# Altium schematic sheet MCU_STM32H743VIT6.SchDoc
size A2; Author: Nguyễn Huy Hoàng; SheetNumber: 5; SheetTotal: 5; Instructor: Nguyễn Trung Hiếu
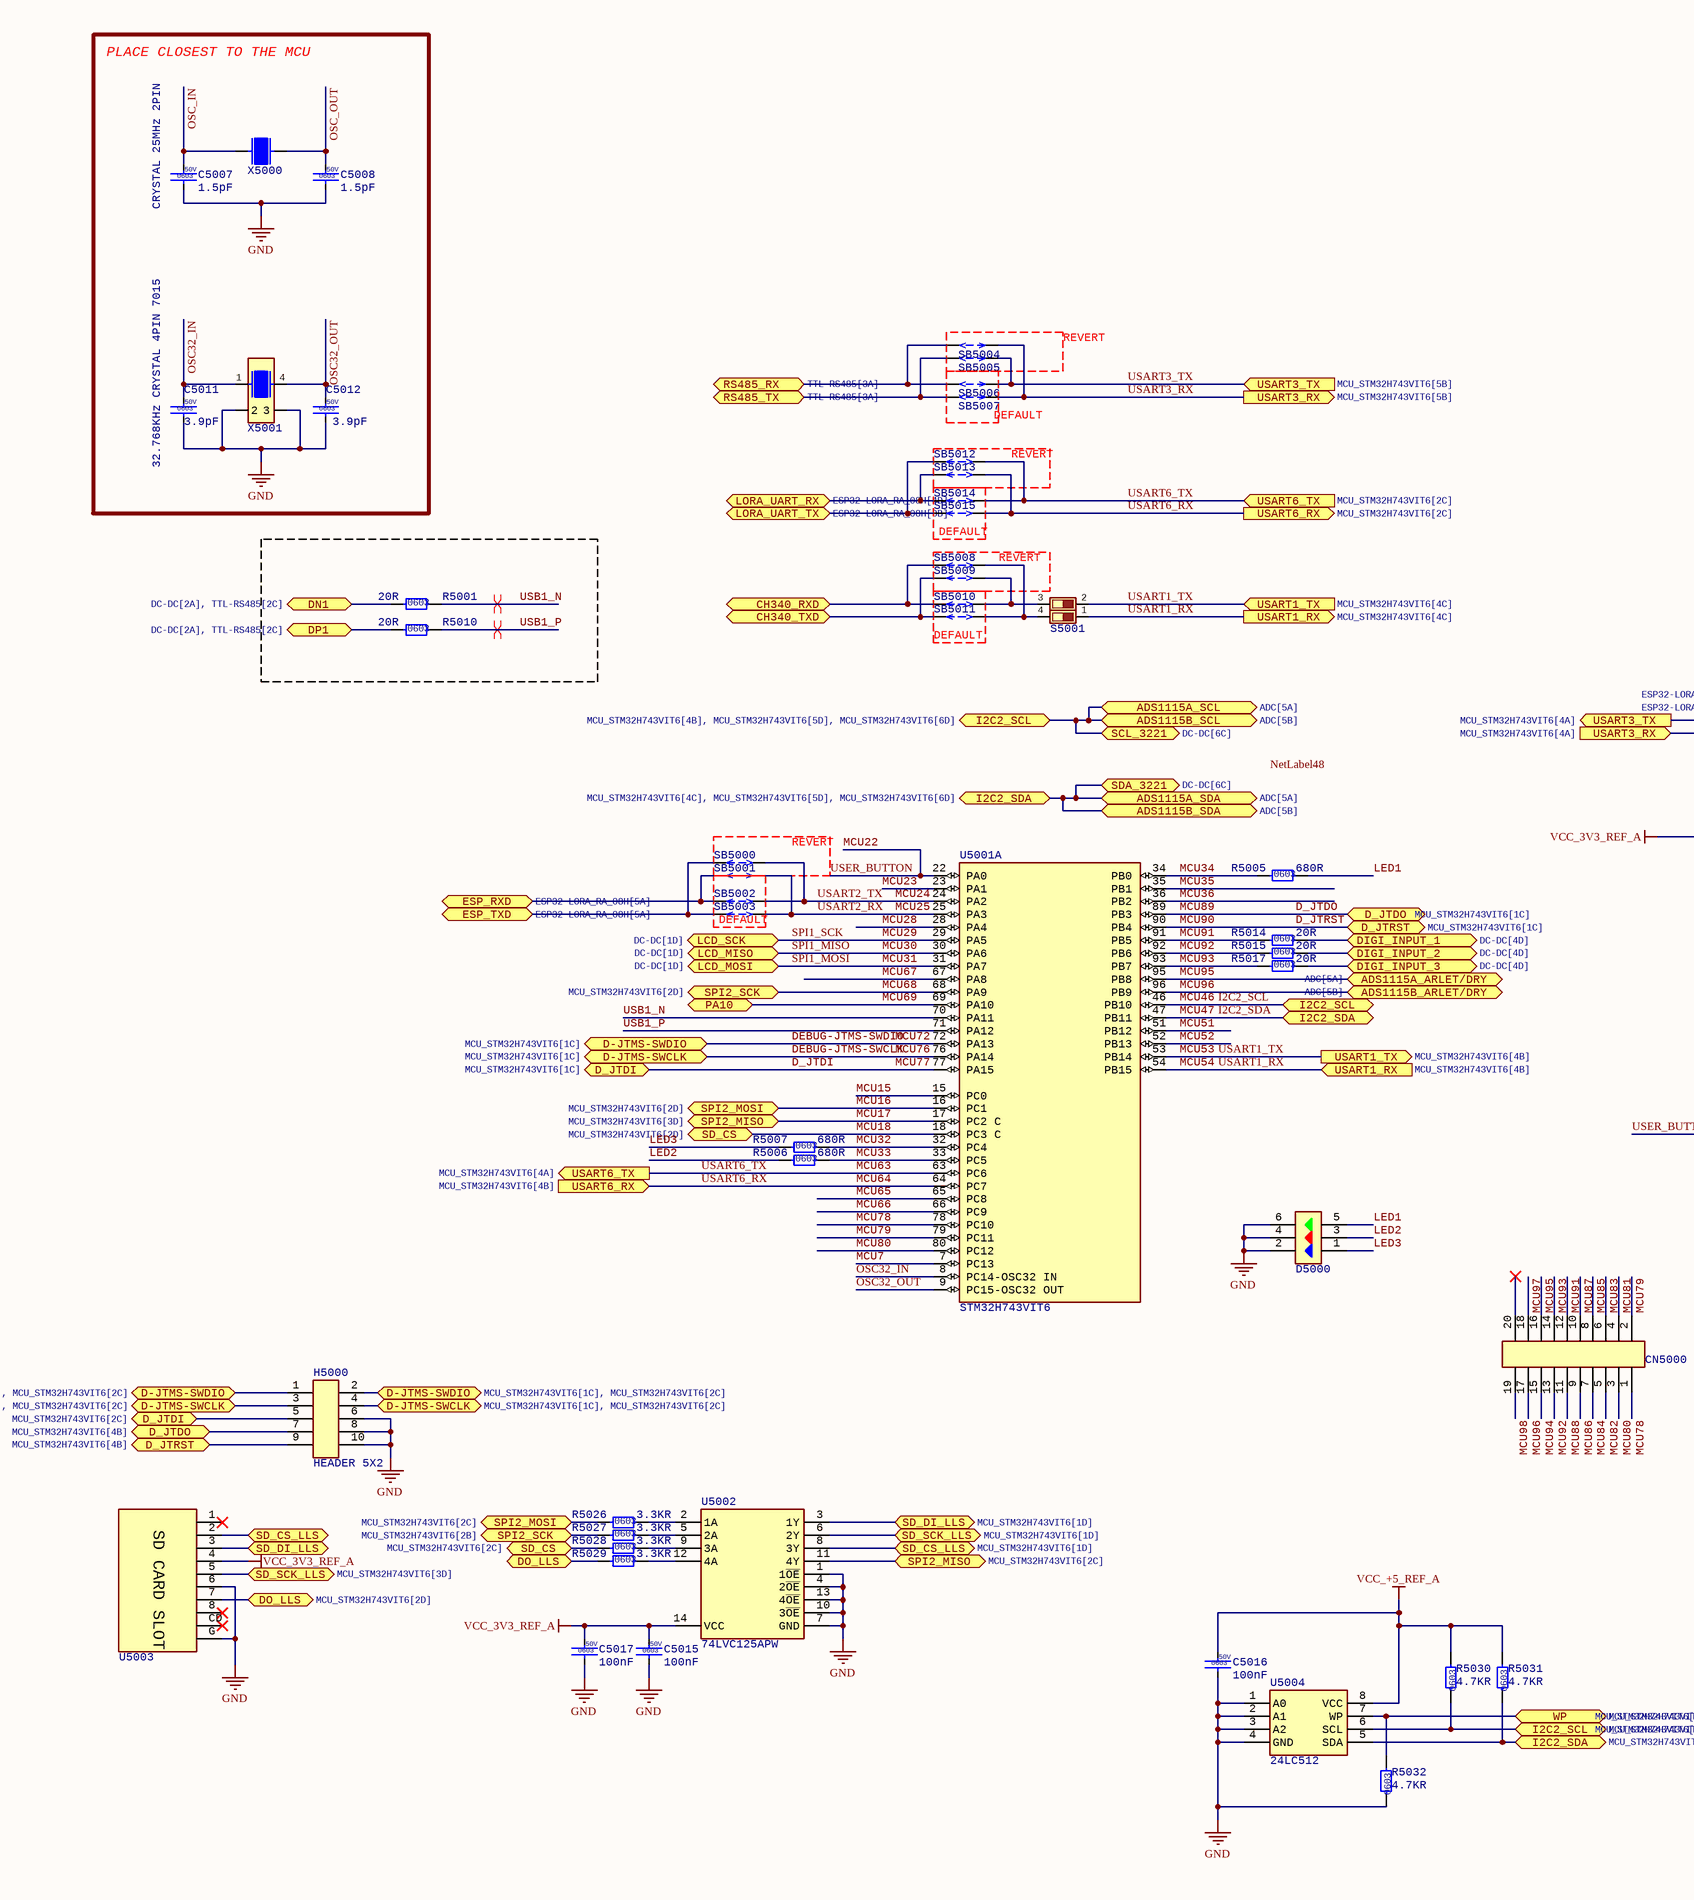
[diagram p0: MCU_STM32H743VIT6.SchDoc, left]
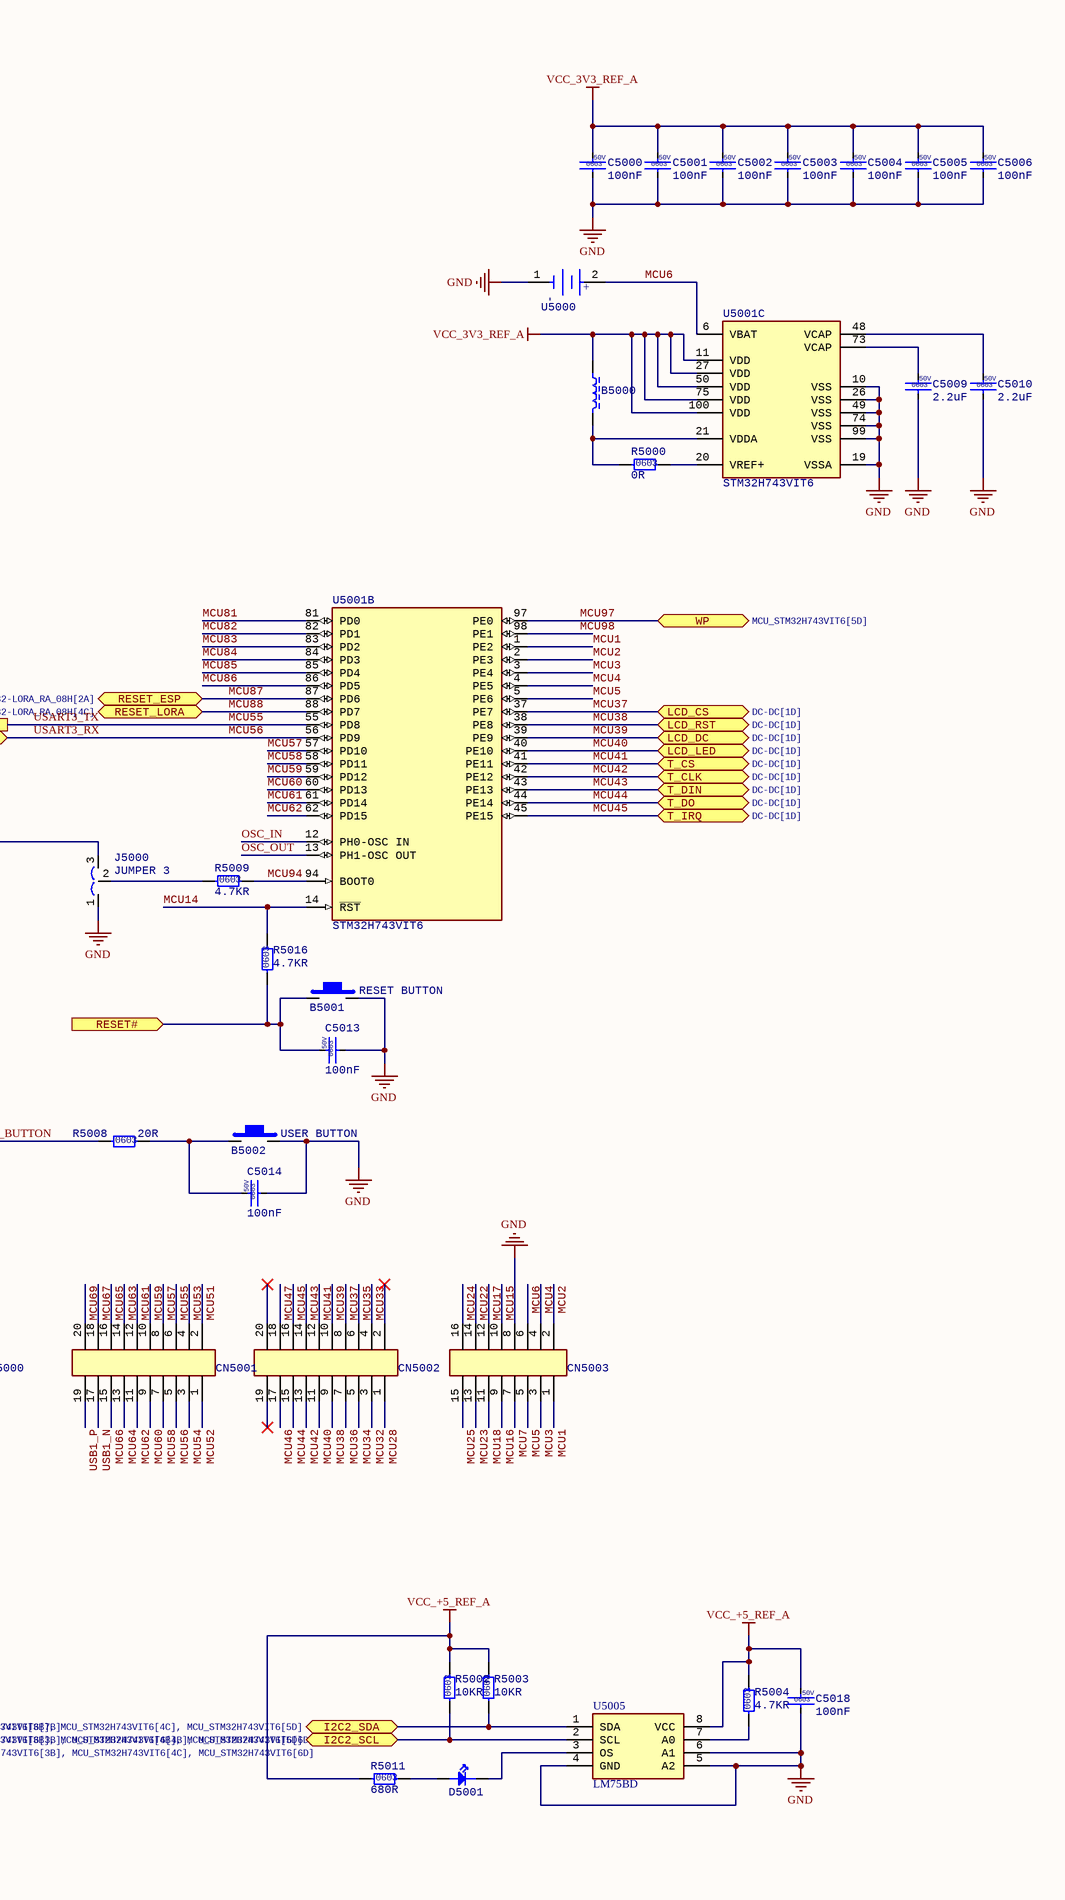
[diagram p1: MCU_STM32H743VIT6.SchDoc, right]

## Parts
B5000  FERRITE BEAD 600 OHM  [FERRITE BEAD 0603]  (value not drawn)
B5001  RESET BUTTON  [TACTILE 3X4MM]
B5002  USER BUTTON  [TACTILE 3X4MM]
C5000  100nF  Voltage: 50V  Size: 0603  [CAP CER 0603]
C5001  100nF  Voltage: 50V  Size: 0603  [CAP CER 0603]
C5002  100nF  Voltage: 50V  Size: 0603  [CAP CER 0603]
C5003  100nF  Voltage: 50V  Size: 0603  [CAP CER 0603]
C5004  100nF  Voltage: 50V  Size: 0603  [CAP CER 0603]
C5005  100nF  Voltage: 50V  Size: 0603  [CAP CER 0603]
C5006  100nF  Voltage: 50V  Size: 0603  [CAP CER 0603]
C5007  1.5pF  Voltage: 50V  Size: 0603  [CAP CER 0603]
C5008  1.5pF  Voltage: 50V  Size: 0603  [CAP CER 0603]
C5009  2.2uF  Voltage: 50V  Size: 0603  [CAP CER 0603]
C5010  2.2uF  Voltage: 50V  Size: 0603  [CAP CER 0603]
C5011  3.9pF  Voltage: 50V  Size: 0603  [CAP CER 0603]
C5012  3.9pF  Voltage: 50V  Size: 0603  [CAP CER 0603]
C5013  100nF  Voltage: 50V  Size: 0603  [CAP CER 0603]
C5014  100nF  Voltage: 50V  Size: 0603  [CAP CER 0603]
C5015  100nF  Voltage: 50V  Size: 0603  [CAP CER 0603]
C5016  100nF  Voltage: 50V  Size: 0603  [CAP CER 0603]
C5017  100nF  Voltage: 50V  Size: 0603  [CAP CER 0603]
C5018  100nF  Voltage: 50V  Size: 0603  [CAP CER 0603]
CN5000  SMD HEADER 10X2X2.54MM  [SMD HEADER 10X2X2.54MM]  (value not drawn)
CN5001  SMD HEADER 10X2X2.54MM  [SMD HEADER 10X2X2.54MM]  (value not drawn)
CN5002  SMD HEADER 10X2X2.54MM  [SMD HEADER 10X2X2.54MM]  (value not drawn)
CN5003  SMD HEADER 8X2X2.54MM  [SMD HEADER 8X2X2.54MM]  (value not drawn)
D5000  LED RGB 5050  [LED RGB 5050]  (value not drawn)
D5001  LED RED  [LED RED 0603]  (value not drawn)
H5000  HEADER 5X2  [HEADER 5X2]
J5000  JUMPER 3  [JUMPER 3]
R5000  0R  Size: 0603  [RESC 0603(1608) SMD]
R5001  20R  Size: 0603  [RESC 0603(1608) SMD]
R5002  10KR  Size: 0603  [RESC 0603(1608) SMD]
R5003  10KR  Size: 0603  [RESC 0603(1608) SMD]
R5004  4.7KR  Size: 0603  [RESC 0603(1608) SMD]
R5005  680R  Size: 0603  [RESC 0603(1608) SMD]
R5006  680R  Size: 0603  [RESC 0603(1608) SMD]
R5007  680R  Size: 0603  [RESC 0603(1608) SMD]
R5008  20R  Size: 0603  [RESC 0603(1608) SMD]
R5009  4.7KR  Size: 0603  [RESC 0603(1608) SMD]
R5010  20R  Size: 0603  [RESC 0603(1608) SMD]
R5011  680R  Size: 0603  [RESC 0603(1608) SMD]
R5014  20R  Size: 0603  [RESC 0603(1608) SMD]
R5015  20R  Size: 0603  [RESC 0603(1608) SMD]
R5016  4.7KR  Size: 0603  [RESC 0603(1608) SMD]
R5017  20R  Size: 0603  [RESC 0603(1608) SMD]
R5026  3.3KR  Size: 0603  [RESC 0603(1608) SMD]
R5027  3.3KR  Size: 0603  [RESC 0603(1608) SMD]
R5028  3.3KR  Size: 0603  [RESC 0603(1608) SMD]
R5029  3.3KR  Size: 0603  [RESC 0603(1608) SMD]
R5030  4.7KR  Size: 0603  [RESC 0603(1608) SMD]
R5031  4.7KR  Size: 0603  [RESC 0603(1608) SMD]
R5032  4.7KR  Size: 0603  [RESC 0603(1608) SMD]
S5001  DIP-2  [DIP-2 SWITCH]  (value not drawn)
SB5000  SB  [SB]  (value not drawn)
SB5001  SB  [SB]  (value not drawn)
SB5002  SB  [SB]  (value not drawn)
SB5003  SB  [SB]  (value not drawn)
SB5004  SB  [SB]  (value not drawn)
SB5005  SB  [SB]  (value not drawn)
SB5006  SB  [SB]  (value not drawn)
SB5007  SB  [SB]  (value not drawn)
SB5008  SB  [SB]  (value not drawn)
SB5009  SB  [SB]  (value not drawn)
SB5010  SB  [SB]  (value not drawn)
SB5011  SB  [SB]  (value not drawn)
SB5012  SB  [SB]  (value not drawn)
SB5013  SB  [SB]  (value not drawn)
SB5014  SB  [SB]  (value not drawn)
SB5015  SB  [SB]  (value not drawn)
U5000  BS-6  [BS-6]  (value not drawn)
U5001  STM32H743VIT6  [LQFP-100-A]  (parts A,B,C of 3)
U5002  74LVC125APW  [TSSOP-14]
U5003  MiSD-PP-9P-V2  [MiSD-PP-9P-V2]  (value not drawn)
U5004  24LC512  [SOIC-8]
U5005  LM75BD  [SOP-8]
X5000  CRYSTAL 25MHz 2PIN  [CRYSTAL 5032 2PIN]
X5001  32.768KHz CRYSTAL 4PIN 7015  [CRYSTAL 32.768KHz 7015]

## Blocks framed on the sheet
PLACE CLOSEST TO THE MCU: C5007 C5008 C5011 C5012 X5000 X5001
DEFAULT: SB5006 SB5007
DEFAULT: SB5014 SB5015
REVERT: SB5012 SB5013
DEFAULT: SB5010 SB5011
REVERT: SB5008 SB5009
REVERT: SB5000 SB5001
DEFAULT: SB5002 SB5003

## Ports
ADS1115A_ARLET/DRY (bidir, see ADC[5A]), ADS1115A_SCL (bidir, see ADC[5A]), ADS1115A_SDA (bidir, see ADC[5A]), ADS1115B_ARLET/DRY (bidir, see ADC[5B]), ADS1115B_SCL (bidir, see ADC[5B]), ADS1115B_SDA (bidir, see ADC[5B]), CH340_RXD (bidir, see ESP32-LORA_RA_08H[1B], ESP32-LORA_RA_08H[2B], TTL-RS485[2B]), CH340_TXD (bidir, see ESP32-LORA_RA_08H[1B], ESP32-LORA_RA_08H[2B], TTL-RS485[2B]), D-JTMS-SWCLK (bidir, see MCU_STM32H743VIT6[1C]), D-JTMS-SWCLK (bidir, see MCU_STM32H743VIT6[1C], MCU_STM32H743VIT6[2C]), D-JTMS-SWDIO (bidir, see MCU_STM32H743VIT6[1C]), D-JTMS-SWDIO (bidir, see MCU_STM32H743VIT6[1C], MCU_STM32H743VIT6[2C]), D_JTDI (bidir, see MCU_STM32H743VIT6[1C]), D_JTDI (bidir, see MCU_STM32H743VIT6[2C]), D_JTDO (bidir, see MCU_STM32H743VIT6[1C]), D_JTDO (bidir, see MCU_STM32H743VIT6[4B]), D_JTRST (bidir, see MCU_STM32H743VIT6[1C]), D_JTRST (bidir, see MCU_STM32H743VIT6[4B]), DIGI_INPUT_1 (bidir, see DC-DC[4D]), DIGI_INPUT_2 (bidir, see DC-DC[4D]), DIGI_INPUT_3 (bidir, see DC-DC[4D]), DN1 (bidir, see DC-DC[2A], TTL-RS485[2C]), DO_LLS (bidir, see MCU_STM32H743VIT6[1D]), DO_LLS (bidir, see MCU_STM32H743VIT6[2D]), DP1 (bidir, see DC-DC[2A], TTL-RS485[2C]), ESP_RXD (bidir, see ESP32-LORA_RA_08H[5A]), ESP_TXD (bidir, see ESP32-LORA_RA_08H[5A]), I2C2_SCL (bidir, see MCU_STM32H743VIT6[3B], MCU_STM32H743VIT6[4B], MCU_STM32H743VIT6[5D]), I2C2_SCL (bidir, see MCU_STM32H743VIT6[3B], MCU_STM32H743VIT6[4B], MCU_STM32H743VIT6[6D]), I2C2_SCL (bidir, see MCU_STM32H743VIT6[3B], MCU_STM32H743VIT6[5D], MCU_STM32H743VIT6[6D]), I2C2_SCL (bidir, see MCU_STM32H743VIT6[4B], MCU_STM32H743VIT6[5D], MCU_STM32H743VIT6[6D]), I2C2_SDA (bidir, see MCU_STM32H743VIT6[3B], MCU_STM32H743VIT6[4C], MCU_STM32H743VIT6[5D]), I2C2_SDA (bidir, see MCU_STM32H743VIT6[3B], MCU_STM32H743VIT6[4C], MCU_STM32H743VIT6[6D]), I2C2_SDA (bidir, see MCU_STM32H743VIT6[3B], MCU_STM32H743VIT6[5D], MCU_STM32H743VIT6[6D]), I2C2_SDA (bidir, see MCU_STM32H743VIT6[4C], MCU_STM32H743VIT6[5D], MCU_STM32H743VIT6[6D]), LCD_CS (bidir, see DC-DC[1D]), LCD_DC (bidir, see DC-DC[1D]), LCD_LED (bidir, see DC-DC[1D]), LCD_MISO (bidir, see DC-DC[1D]), LCD_MOSI (bidir, see DC-DC[1D]), LCD_RST (bidir, see DC-DC[1D]), LCD_SCK (bidir, see DC-DC[1D]), LORA_UART_RX (bidir, see ESP32-LORA_RA_08H[4D]), LORA_UART_TX (bidir, see ESP32-LORA_RA_08H[3B]), PA10 (bidir), RESET# (in), RESET_ESP (bidir, see ESP32-LORA_RA_08H[2A]), RESET_LORA (bidir, see ESP32-LORA_RA_08H[4C]), RS485_RX (bidir, see TTL-RS485[3A]), RS485_TX (bidir, see TTL-RS485[3A]), SCL_3221 (bidir, see DC-DC[6C]), SD_CS (bidir, see MCU_STM32H743VIT6[2C]), SD_CS (bidir, see MCU_STM32H743VIT6[2D]), SD_CS_LLS (bidir, see MCU_STM32H743VIT6[1D]), SD_CS_LLS (bidir, see MCU_STM32H743VIT6[3D]), SD_DI_LLS (bidir, see MCU_STM32H743VIT6[1D]), SD_DI_LLS (bidir, see MCU_STM32H743VIT6[3D]), SD_SCK_LLS (bidir, see MCU_STM32H743VIT6[1D]), SD_SCK_LLS (bidir, see MCU_STM32H743VIT6[3D]), SDA_3221 (bidir, see DC-DC[6C]), SPI2_MISO (bidir, see MCU_STM32H743VIT6[2C]), SPI2_MISO (bidir, see MCU_STM32H743VIT6[3D]), SPI2_MOSI (bidir, see MCU_STM32H743VIT6[2C]), SPI2_MOSI (bidir, see MCU_STM32H743VIT6[2D]), SPI2_SCK (bidir, see MCU_STM32H743VIT6[2B]), SPI2_SCK (bidir, see MCU_STM32H743VIT6[2D]), T_CLK (bidir, see DC-DC[1D]), T_CS (bidir, see DC-DC[1D]), T_DIN (bidir, see DC-DC[1D]), T_DO (bidir, see DC-DC[1D]), T_IRQ (bidir, see DC-DC[1D]), USART1_RX (in, see MCU_STM32H743VIT6[4B]), USART1_RX (out, see MCU_STM32H743VIT6[4C]), USART1_TX (in, see MCU_STM32H743VIT6[4C]), USART1_TX (out, see MCU_STM32H743VIT6[4B]), USART3_RX (in, see MCU_STM32H743VIT6[4A]), USART3_RX (out, see MCU_STM32H743VIT6[5B]), USART3_TX (in, see MCU_STM32H743VIT6[5B]), USART3_TX (out, see MCU_STM32H743VIT6[4A]), USART6_RX (in, see MCU_STM32H743VIT6[4B]), USART6_RX (out, see MCU_STM32H743VIT6[2C]), USART6_TX (in, see MCU_STM32H743VIT6[2C]), USART6_TX (out, see MCU_STM32H743VIT6[4A]), WP (bidir, see MCU_STM32H743VIT6[5D]), WP (bidir, see MCU_STM32H743VIT6[7B])

## Nets
GND: B5001.2 B5002.2 C5000.2 C5001.2 C5002.2 C5003.2 C5004.2 C5005.2 C5006.2 C5007.2 C5008.2 C5009.2 C5010.2 C5011.2 C5012.2 C5013.2 C5014.2 C5015.2 C5016.2 C5017.2 C5018.2 CN5003.8 D5000.2 D5000.4 D5000.6 H5000.6 H5000.8 H5000.10 J5000.1 R5032.2 U5000.1(C) U5001.10(VSS) U5001.19(VSSA) U5001.26(VSS) U5001.49(VSS) U5001.74(VSS) U5001.99(VSS) U5002.1(1~{OE}) U5002.4(2~{OE}) U5002.7(GND) U5002.10(3~{OE}) U5002.13(4~{OE}) U5003.6 U5003.G U5004.1(A0) U5004.2(A1) U5004.3(A2) U5004.4(GND) U5005.4(GND) U5005.5(A2) U5005.6(A1) X5001.2 X5001.3
VCC_3V3_REF_A: B5000.1 C5000.1 C5001.1 C5002.1 C5003.1 C5004.1 C5005.1 C5006.1 C5015.1 C5017.1 J5000.3 U5001.11(VDD) U5001.27(VDD) U5001.50(VDD) U5001.75(VDD) U5001.100(VDD) U5002.14(VCC) U5003.4
VCC_+5_REF_A: C5016.1 C5018.1 R5002.2 R5003.2 R5004.2 R5011.1 R5030.1 R5031.1 U5004.8(VCC) U5005.8(VCC)
CH340_RXD: SB5008.1 SB5010.1 ; port CH340_RXD
CH340_TXD: SB5009.1 SB5011.1 ; port CH340_TXD
D_JTDI: H5000.5 U5001.77(PA15) ; port D_JTDI  [also labelled MCU77]
D_JTDO: H5000.7 U5001.89(PB3) ; port D_JTDO  [also labelled MCU89]
D_JTRST: H5000.9 U5001.90(PB4) ; port D_JTRST  [also labelled MCU90]
DEBUG-JTMS-SWCLK: H5000.3 H5000.4 U5001.76(PA14) ; port D-JTMS-SWCLK  [also labelled MCU76]
DEBUG-JTMS-SWDIO: H5000.1 H5000.2 U5001.72(PA13) ; port D-JTMS-SWDIO  [also labelled MCU72]
DIGI_INPUT_1: R5014.2 ; port DIGI_INPUT_1
DIGI_INPUT_2: R5015.2 ; port DIGI_INPUT_2
DIGI_INPUT_3: R5017.2 ; port DIGI_INPUT_3
DN1: R5001.1 ; port DN1
DO_LLS: R5029.1 U5003.7 ; port DO_LLS
DP1: R5010.1 ; port DP1
ESP_RXD: SB5001.1 SB5002.1 ; port ESP_RXD
ESP_TXD: SB5000.1 SB5003.1 ; port ESP_TXD
I2C2_SCL: CN5002.17 R5002.1 R5030.2 U5001.46(PB10) U5004.6(SCL) U5005.2(SCL) ; port ADS1115A_SCL, port ADS1115B_SCL, port SCL_3221, port I2C2_SCL  [also labelled MCU46]
I2C2_SDA: CN5002.18 R5003.1 R5031.2 U5001.47(PB11) U5004.5(SDA) U5005.1(SDA) ; port ADS1115A_SDA, port ADS1115B_SDA, port SDA_3221, port I2C2_SDA  [also labelled MCU47]
LED1: D5000.5 R5005.2
LED2: D5000.3 R5006.1
LED3: D5000.1 R5007.1
LORA_UART_RX: SB5013.1 SB5014.1 ; port LORA_UART_RX
LORA_UART_TX: SB5012.1 SB5015.1 ; port LORA_UART_TX
MCU1: CN5003.1 U5001.1(PE2)
MCU2: CN5003.2 U5001.2(PE3)
MCU3: CN5003.3 U5001.3(PE4)
MCU4: CN5003.4 U5001.4(PE5)
MCU5: CN5003.5 U5001.5(PE6)
MCU6: CN5003.6 U5000.2(A) U5001.6(VBAT)
MCU7: CN5003.7 U5001.7(PC13)
MCU14: R5016.2 U5001.14(~{RST})
MCU15: CN5003.10 U5001.15(PC0)
MCU16: CN5003.9 R5026.1 U5001.16(PC1) ; port SPI2_MOSI
MCU17: CN5003.12 U5001.17(PC2_C) U5002.11(4Y) ; port SPI2_MISO
MCU18: CN5003.11 R5028.1 U5001.18(PC3_C) ; port SD_CS
MCU22: CN5003.14 R5008.1 U5001.22(PA0)  [also labelled USER_BUTTON]
MCU23: CN5003.13 U5001.23(PA1)
MCU24: CN5003.16 SB5000.2 SB5002.2 U5001.24(PA2)  [also labelled USART2_TX]
MCU25: CN5003.15 SB5001.2 SB5003.2 U5001.25(PA3)  [also labelled USART2_RX]
MCU28: CN5002.1 U5001.28(PA4)
MCU29: U5001.29(PA5) ; port LCD_SCK  [also labelled SPI1_SCK]
MCU30: U5001.30(PA6) ; port LCD_MISO  [also labelled SPI1_MISO]
MCU31: U5001.31(PA7) ; port LCD_MOSI  [also labelled SPI1_MOSI]
MCU32: CN5002.3 R5007.2 U5001.32(PC4)
MCU33: CN5002.4 R5006.2 U5001.33(PC5)
MCU34: CN5002.5 R5005.1 U5001.34(PB0)
MCU35: CN5002.6 U5001.35(PB1)
MCU36: CN5002.7 U5001.36(PB2)
MCU37: CN5002.8 U5001.37(PE7) ; port LCD_CS
MCU38: CN5002.9 U5001.38(PE8) ; port LCD_RST
MCU39: CN5002.10 U5001.39(PE9) ; port LCD_DC
MCU40: CN5002.11 U5001.40(PE10) ; port LCD_LED
MCU41: CN5002.12 U5001.41(PE11) ; port T_CS
MCU42: CN5002.13 U5001.42(PE12) ; port T_CLK
MCU43: CN5002.14 U5001.43(PE13) ; port T_DIN
MCU44: CN5002.15 U5001.44(PE14) ; port T_DO
MCU45: CN5002.16 U5001.45(PE15) ; port T_IRQ
MCU51: CN5001.2 U5001.51(PB12)
MCU52: CN5001.1 U5001.52(PB13)
MCU53: CN5001.4 S5001.2 U5001.53(PB14) ; port USART1_TX  [also labelled USART1_TX]
MCU54: CN5001.3 S5001.1 U5001.54(PB15) ; port USART1_RX  [also labelled USART1_RX]
MCU55: CN5001.6 SB5005.1 SB5006.1 U5001.55(PD8) ; port USART3_TX  [also labelled USART3_TX]
MCU56: CN5001.5 SB5004.1 SB5007.1 U5001.56(PD9) ; port USART3_RX  [also labelled USART3_RX]
MCU57: CN5001.8 U5001.57(PD10)
MCU58: CN5001.7 U5001.58(PD11)
MCU59: CN5001.10 U5001.59(PD12)
MCU60: CN5001.9 U5001.60(PD13)
MCU61: CN5001.12 U5001.61(PD14)
MCU62: CN5001.11 U5001.62(PD15)
MCU63: CN5001.14 SB5012.2 SB5014.2 U5001.63(PC6) ; port USART6_TX  [also labelled USART6_TX]
MCU64: CN5001.13 SB5013.2 SB5015.2 U5001.64(PC7) ; port USART6_RX  [also labelled USART6_RX]
MCU65: CN5001.16 U5001.65(PC8)
MCU66: CN5001.15 U5001.66(PC9)
MCU67: CN5001.18 U5001.67(PA8)
MCU68: R5027.1 U5001.68(PA9) ; port SPI2_SCK
MCU69: CN5001.20 U5001.69(PA10) ; port PA10
MCU78: CN5000.1 U5001.78(PC10)
MCU79: CN5000.2 U5001.79(PC11)
MCU80: CN5000.3 U5001.80(PC12)
MCU81: CN5000.4 U5001.81(PD0)
MCU82: CN5000.5 U5001.82(PD1)
MCU83: CN5000.6 U5001.83(PD2)
MCU84: CN5000.7 U5001.84(PD3)
MCU85: CN5000.8 U5001.85(PD4)
MCU86: CN5000.9 U5001.86(PD5)
MCU87: CN5000.10 U5001.87(PD6) ; port RESET_ESP
MCU88: CN5000.11 U5001.88(PD7) ; port RESET_LORA
MCU91: CN5000.12 R5014.1 U5001.91(PB5)
MCU92: CN5000.13 R5015.1 U5001.92(PB6)
MCU93: CN5000.14 R5017.1 U5001.93(PB7)
MCU94: CN5000.15 R5009.2 U5001.94(BOOT0)
MCU95: CN5000.16 U5001.95(PB8) ; port ADS1115A_ARLET/DRY
MCU96: CN5000.17 U5001.96(PB9) ; port ADS1115B_ARLET/DRY
MCU97: CN5000.18 R5032.1 U5001.97(PE0) U5004.7(WP) ; port WP
MCU98: CN5000.19 U5001.98(PE1)
OSC32_IN: C5011.1 U5001.8(PC14-OSC32_IN) X5001.1
OSC32_OUT: C5012.1 U5001.9(PC15-OSC32_OUT) X5001.4
OSC_IN: C5007.1 U5001.12(PH0-OSC_IN) X5000.1
OSC_OUT: C5008.1 U5001.13(PH1-OSC_OUT) X5000.2
RESET#: B5001.1 C5013.1 R5016.1 ; port RESET#
RS485_RX: SB5004.2 SB5006.2 ; port RS485_RX
RS485_TX: SB5005.2 SB5007.2 ; port RS485_TX
SD_CS_LLS: U5002.8(3Y) U5003.2 ; port SD_CS_LLS
SD_DI_LLS: U5002.3(1Y) U5003.3 ; port SD_DI_LLS
SD_SCK_LLS: U5002.6(2Y) U5003.5 ; port SD_SCK_LLS
USB1_N: CN5001.17 R5001.2 U5001.70(PA11)
USB1_P: CN5001.19 R5010.2 U5001.71(PA12)
NetB5000_2: B5000.2 R5000.1 U5001.21(VDDA)
NetB5002_1: B5002.1 C5014.1 R5008.2
NetC5009_1: C5009.1 U5001.73(VCAP)
NetC5010_1: C5010.1 U5001.48(VCAP)
NetD5001_1: D5001.1 R5011.2
NetD5001_2: D5001.2 U5005.3(OS)
NetJ5000_2: J5000.2 R5009.1
NetR5000_2: R5000.2 U5001.20(VREF+)
NetR5004_1: R5004.1 U5005.7(A0)
NetR5026_2: R5026.2 U5002.2(1A)
NetR5027_2: R5027.2 U5002.5(2A)
NetR5028_2: R5028.2 U5002.9(3A)
NetR5029_2: R5029.2 U5002.12(4A)
NetS5001_3: S5001.3 SB5009.2 SB5010.2
NetS5001_4: S5001.4 SB5008.2 SB5011.2

Not connected (* = marked no-connect by the designer): CN5000 20*; CN5002 2* 19* 20*; U5003 1* 8* CD*

## Layout directives
differential pair: USB1_N, USB1_P

## Notes on the sheet
- REVERT
- Labels drawn without touching a wire or pin: NetLabel48
- PROJECT:
- A2
- SIZE
- Author:
- Instructors:
- Project Document Name:
- Modified day:
- Approved by:
- (in symbol FF-3016) SD CARD SLOT
- (in symbol FF-3017) +; -

## Library data of the parts
B5000 = FF-4021: FERRITE BEAD 600 OHM 0603 1LN; TH/SMD: SMD; Value: 600 OHM; Design Item ID: FF-4021; Type: FERRITE BEAD; Tolerance: N/A; Voltage: N/A; Power Rate: N/A; Size: 0603; Supplier: THEGIOIIC; Supplier Part Number: FERRITE BEAD 600 OHM 0603 1LN; Supplier Link: https://www.thegioiic.com/ferrite-bead-600-ohm-0603-1ln
B5001 B5002 = FF-3007: Nút Nhấn 3x4mm Cao 2.5mm 2 Chân SMD; Design Item ID: FF-3007; Type: BUTTON; TH/SMD: SMD; Value: N/A; Tolerance: N/A; Voltage: N/A; Power Rate: N/A; Size: 3X4MM; Supplier: THEGIOIIC; Supplier Part Number: Nút Nhấn 3x4mm Cao 2.5mm 2 Chân SMD; Supplier Link: https://www.thegioiic.com/nut-nhan-3x4mm-cao-2-5mm-2-chan-smd
C5000-C5006 C5013-C5018 = FF-1008: CAP CER SMD 100nF 10% 50V 0603; Type: CAP CER; Design Item ID: FF-1008; TH/SMD: SMD; Value: 100nF; Tolerance: 10%; Power Rate: N/A; Supplier: THEGIOIIC; Supplier Part Number: 10%, 0603 (1608 Metric); Supplier Link: https://www.thegioiic.com/tu-gom-0603-100nf-0-1uf-50v
C5007 C5008 = FF-1013: CAP CER SMD 1.5pF 10% 50V 0603; Type: CAP CER; Design Item ID: FF-1013; TH/SMD: SMD; Value: 1.5pF; Tolerance: 10%; Power Rate: N/A; Supplier: THEGIOIIC; Supplier Part Number: 10%, 0603 (1608 Metric); Supplier Link: https://www.thegioiic.com/tu-gom-0603-1-5pf-50v
C5009 C5010 = FF-1004: CAP CER SMD 2.2uF 10% 50V 0603; Type: CAP CER; Design Item ID: FF-1004; TH/SMD: SMD; Value: 2.2uF; Tolerance: 10%; Power Rate: N/A; Supplier: THEGIOIIC; Supplier Part Number: 10%, 0603 (1608 Metric); Supplier Link: https://www.thegioiic.com/tu-gom-0603-2-2uf-50v
C5011 C5012 = FF-1014: CAP CER SMD 3.9pF 10% 50V 0603; Type: CAP CER; Design Item ID: FF-1014; TH/SMD: SMD; Value: 3.9pF; Tolerance: 10%; Power Rate: N/A; Supplier: N/A; Supplier Part Number: N/A; Supplier Link: N/A
CN5000-CN5002 = FF-3025: Design Item ID: FF-3025; Type: CONNECTOR; TH/SMD: SMD; Value: N/A; Tolerance: N/A; Voltage: N/A; Power Rate: N/A; Size: N/A; Supplier: N/A; Supplier Part Number: N/A; Supplier Link: N/A
CN5003 = FF-3021: Design Item ID: FF-3021; Type: CONNECTOR; TH/SMD: SMD; Value: N/A; Tolerance: N/A; Voltage: N/A; Power Rate: N/A; Size: 8X2X2.54MM; Supplier: THEGIOIIC; Supplier Part Number: Hàng Rào Đực Đôi 2.54mm 80 Chân 2 Hàng SMD; Supplier Link: https://www.thegioiic.com/hang-rao-duc-doi-2-54mm-80-chan-2-hang-smd
D5000 = FF-4018: LED RGB 5050 Dán SMD Trong Suốt; Value: 5 x 5 x 1.5mm; Design Item ID: FF-4018; Type: LED RGB; TH/SMD: SMD; Tolerance: N/A; Voltage: N/A; Power Rate: N/A; Size: 5050; Supplier: THEGIOIIC; Supplier Part Number: LED RGB 5050 Dán SMD Trong Suốt; Supplier Link: https://www.thegioiic.com/led-rgb-5050-dan-smd-trong-suot
D5001 = FF-4011: LED RED 0603; TH/SMD: SMD; Design Item ID: FF-4011; Type: LED; Value: N/A; Tolerance: N/A; Voltage: N/A; Power Rate: N/A; Size: 0603; Supplier: THEGIOIIC; Supplier Part Number: LED Đỏ 0603 Dán SMD Trong Suốt; Supplier Link: https://www.thegioiic.com/led-do-0603-dan-smd-trong-suot
H5000 = FF-3020: TH/SMD: TH; Design Item ID: FF-3020; Type: JUMPER; Value: N/A; Tolerance: N/A; Voltage: N/A; Power Rate: N/A; Size: 5X2 X 2.54mm; Supplier: N/A; Supplier Part Number: N/A; Supplier Link: N/A
J5000 = FF-3014: TH/SMD: TH; Design Item ID: FF-3014; Type: JUMPER; Value: N/A; Tolerance: N/A; Voltage: N/A; Power Rate: N/A; Size: 2 X 2.54mm; Supplier: N/A; Supplier Part Number: N/A; Supplier Link: N/A
R5000 = FF-0003: RESISTOR SMD 0R OHM 1% 100mW 0603; Power Rate: 100mW; Design Item ID: FF-0003; Type: RESISTOR; TH/SMD: SMD; Value: 0R; Tolerance: 1%; Voltage: N/A; Supplier: THEGIOIIC; Supplier Part Number: 0R0, 1/10W; Supplier Link: https://www.thegioiic.com/dien-tro-0-ohm-0603-1-
R5001 R5008 R5010 R5014 R5015 R5017 = FF-0022: RESISTOR SMD 20R OHM 1% 100mW 0603; Power Rate: 100mW; Design Item ID: FF-0022; Type: RESISTOR; TH/SMD: SMD; Value: 20R; Tolerance: 1%; Voltage: N/A; Supplier: THEGIOIIC; Supplier Part Number: 20R (Code 200), 1/10W; Supplier Link: https://www.thegioiic.com/dien-tro-20-ohm-0603-1-
R5002 R5003 = FF-0020: RESISTOR SMD 10KR OHM 1% 100mW 0603; Power Rate: 100mW; Design Item ID: FF-0020; Type: RESISTOR; TH/SMD: SMD; Value: 10KR; Tolerance: 1%; Voltage: N/A; Supplier: THEGIOIIC; Supplier Part Number: 103, 1/10W; Supplier Link: https://www.thegioiic.com/dien-tro-10-kohm-0603-1-
R5004 R5009 R5016 R5030-R5032 = FF-0016: RESISTOR SMD 4.7KR OHM 1% 100mW 0603; Power Rate: 100mW; Design Item ID: FF-0016; Type: RESISTOR; TH/SMD: SMD; Value: 4.7KR; Tolerance: 1%; Voltage: N/A; Supplier: THEGIOIIC; Supplier Part Number: 472, 1/10W; Supplier Link: https://www.thegioiic.com/dien-tro-4-7-kohm-0603-1-
R5005-R5007 R5011 = FF-0001: RESISTOR SMD 680R OHM 5% 100mW 0603; Power Rate: 100mW; Design Item ID: FF-0001; Type: RESISTOR; TH/SMD: SMD; Value: 680R; Tolerance: 5%; Voltage: N/A; Supplier: THEGIOIIC; Supplier Part Number: 681, 1/10W; Supplier Link: https://www.thegioiic.com/dien-tro-680-ohm-0603-5-
R5026-R5029 = FF-0051: RESISTOR SMD 3.3KR OHM 1% 100mW 0603; Power Rate: 100mW; Design Item ID: FF-0051; Type: RESISTOR; TH/SMD: SMD; Value: 3.3KR; Tolerance: 1%; Voltage: N/A; Supplier: THEGIOIIC; Supplier Part Number: Điện Trở 3.3 KOhm 0603 1%; Supplier Link: https://www.thegioiic.com/dien-tro-3-3-kohm-0603-1-
S5001 = FF-3009: DIP SWITCH 1.27mm 2 CONTACT; TH/SMD: SMD; Design Item ID: FF-3009; Type: SWITCH; Value: N/A; Tolerance: N/A; Voltage: N/A; Power Rate: N/A; Size: 2 X 1.27mm; Supplier: THEGIOIIC; Supplier Part Number: Công Tắc DIP Switch Dán SMD 2 Bit 1.27mm; Supplier Link: https://www.thegioiic.com/cong-tac-dip-switch-dan-smd-2-bit-1-27mm
SB5000-SB5015 = FF-0052: RESISTOR SMD 0R OHM 1% 100mW 0603; Design Item ID: FF-0052; Power Rate: 100mW; Size: 0603; Type: RESISTOR; TH/SMD: SMD; Value: 0R; Tolerance: 1%; Voltage: N/A; Supplier: THEGIOIIC; Supplier Part Number: N/A; Supplier Link: N/A
U5000 = FF-3017: BS-6 Đế Pin CR2032 CR2025 Dán SMD; TH/SMD: SMD/TH; Design Item ID: FF-3017; Type: CONNECTOR; Value: N/A; Tolerance: N/A; Voltage: N/A; Power Rate: N/A; Size: BS-6; Supplier: THEGIOIIC; Supplier Part Number: BS-6 Đế Pin CR2032 CR2025 Dán SMD; Supplier Link: https://www.thegioiic.com/bs-6-de-pin-cr2032-cr2025-dan-smd
U5001 = FF-2011: 32-bit Arm® Cortex®-M7 480MHz MCUs, up to 2MB flash, up to 1MB RAM, 46 com. and analog interfaces; TH/SMD: SMD; Design Item ID: FF-2011; Type: IC; Value: STM32H743VIT6; Tolerance: N/A; Voltage: N/A; Power Rate: N/A; Size: LQFP-100; Supplier: SELF
U5002 = FF-2023: Quad buffer/line driver with 5 V tolerant input/outputs; 3-state; TH/SMD: SMD; Design Item ID: FF-2023; Type: IC; Value: 74LVC125APW; Tolerance: N/A; Voltage: N/A; Power Rate: N/A; Size: TSSOP-14; Supplier: THEGIOIIC; Supplier Part Number: 74LVC125APW; Supplier Link: N/A
U5003 = FF-3016: SDCARD SLOT 9 PIN PUSH PULL; TH/SMD: SMD/TH; Design Item ID: FF-3016; Type: CONNECTOR; Value: N/A; Tolerance: N/A; Voltage: N/A; Power Rate: N/A; Size: MiSD-PP-9P-V2; Supplier: THEGIOIIC; Supplier Part Number: MiSD-PP-9P-V2 Khay Thẻ Nhớ MicroSD 9 Chân Push-Push; Supplier Link: https://www.thegioiic.com/misd-pp-9p-v2-khay-the-nho-microsd-9-chan-push-push
U5004 = FF-2022: 512K I2C Serial EEPROM; TH/SMD: SMD; Design Item ID: FF-2022; Type: IC; Value: 24LC512; Tolerance: N/A; Voltage: N/A; Power Rate: N/A; Size: SOIC-8; Supplier: THEGIOIIC; Supplier Part Number: 24LC512; Supplier Link: https://www.thegioiic.com/24lc512t-i-sn-ic-eeprom-512kbit-8-soic
U5005 = FF-2025: Digital temperature sensor and thermal watchdog; TH/SMD: SMD; Design Item ID: FF-2025; Type: IC; Value: LM75BD; Tolerance: N/A; Voltage: N/A; Power Rate: N/A; Size: SOP-8; Supplier: THEGIOIIC; Supplier Part Number: LM75BD; Supplier Link: N/A
X5000 = FF-4023: CRYSTAL 25MHz 2PIN SMD 5 x 3.2mm, ±20ppm 12pF; Design Item ID: FF-4023; Type: CRYSTAL; TH/SMD: SMD; Value: 25MHz; Tolerance: N/A; Voltage: N/A; Power Rate: N/A; Size: 5032; Supplier: THEGIOIIC; Supplier Part Number: Thạch Anh 25MHz 5032 2 Chân SMD; Supplier Link: https://www.thegioiic.com/thach-anh-25mhz-5032-2-chan-smd
X5001 = FF-4022: 32.768kHz ±20ppm, 9pF 65kOhm, 7x1.5x1.4 mm; TH/SMD: SMD; Design Item ID: FF-4022; Type: CRYSTAL; Value: N/A; Tolerance: N/A; Voltage: N/A; Power Rate: N/A; Size: 7015; Supplier: THEGIOIIC; Supplier Part Number: Thach Anh 32.768KHz MC-146 Crystal 7015 4 Chân; Supplier Link: https://www.thegioiic.com/thach-anh-32-768khz-mc-146-crystal-7015-4-chan